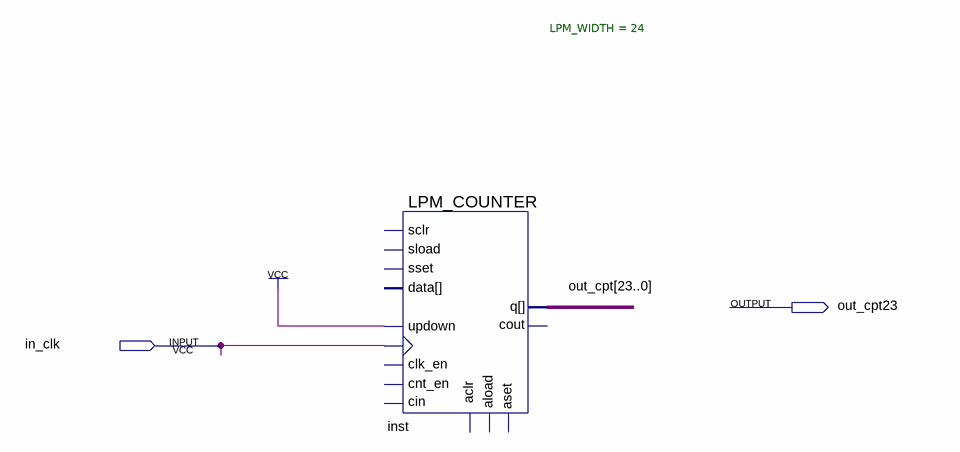
[diagram p0: schematic sheet]
// Quartus schematic Dvide_Freq.bdf as structural Verilog: 1 symbols, 2 pins
module Dvide_Freq (
  input  in_clk,
  output out_cpt23
);

  wire [22:0] out_cpt;

  LPM_COUNTER #(.LPM_WIDTH(24)) inst (
    .clock(in_clk), .updown(1'b1), .q({out_cpt23, out_cpt}));  // open: sload, data, clk_en, aload, aclr, aset, cin, sset, cnt_en, sclr, cout
endmodule
